# EAGLE design USB3.0 (EAGLE 9.6.1)
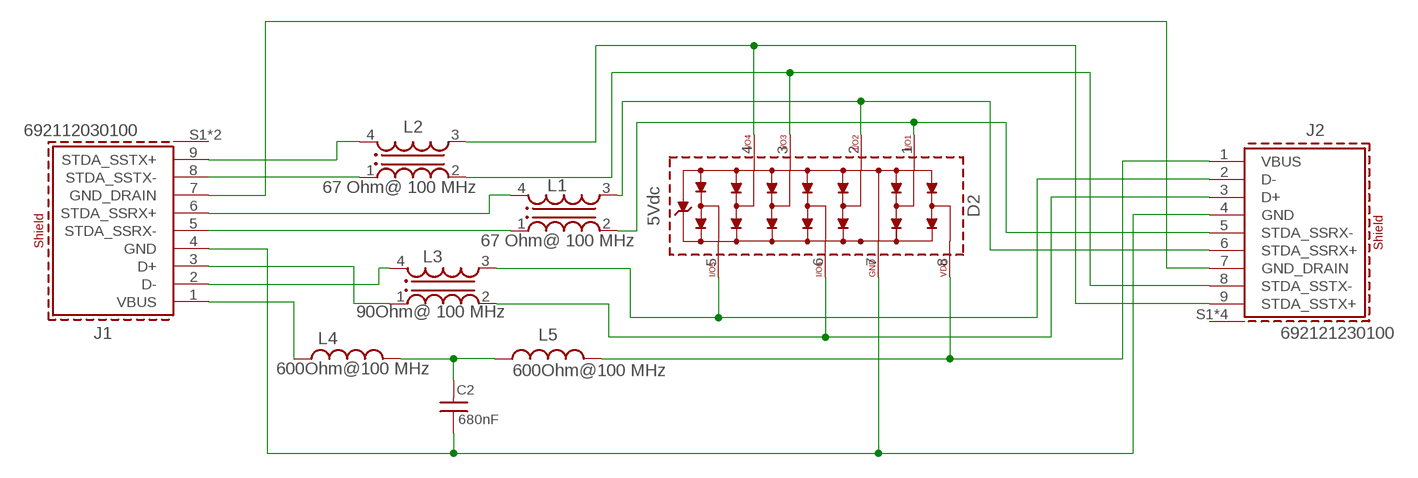
[diagram p0: schematic, sheet 1]

## Parts
C2  680nF  WCAP-CSGP_0603_885012206051_16V(DC)_W  [WCAP-CSGP_0603_W]
D2  5Vdc  WE-TVS-SS_MSOP-8L_82401646  [WE-TVS_MSOP-8L]
J1  692112030100  [692112030100]
J2  692121230100  [692121230100]
L1  67 Ohm@ 100 MHz  WE-CNSW_HF_0805_744233670  [WE-CNSW_HF_0805]
L2  67 Ohm@ 100 MHz  WE-CNSW_HF_0805_744233670  [WE-CNSW_HF_0805]
L3  90Ohm@ 100 MHz  WE-CNSW_1206_744232090  [WE-CNSW_1206]
L4  600Ohm@100 MHz  WE-CBF_0805_742792040_HC  [WE-CBF_0805(W=4.0)]
L5  600Ohm@100 MHz  WE-CBF_0805_742792040_HC  [WE-CBF_0805(W=4.0)]

## Nets
D_N: D2.5(I/O5) J2.2(D-) L3.3
D_P: D2.6(I/O6) J2.3(D+) L3.2
DX_N: J1.2(D-) L3.4
DX_P: J1.3(D+) L3.1
N$2: D2.8(VDD) J2.1(VBUS) L5.2
N$3: J1.7(GND_DRAIN) J2.7(GND_DRAIN)
N$5: C2.1 D2.7(GND) J1.4(GND) J2.4(GND)
N$11: C2.2 L4.2 L5.1
N$16: J1.1(VBUS) L4.1
R_N: D2.1(I/O1) J2.5(STDA_SSRX-) L1.2
R_P: D2.2(I/O2) J2.6(STDA_SSRX+) L1.3
RX_N: J1.5(STDA_SSRX-) L1.1
RX_P: J1.6(STDA_SSRX+) L1.4
T_N: D2.3(I/O3) J2.8(STDA_SSTX-) L2.2
T_P: D2.4(I/O4) J2.9(STDA_SSTX+) L2.3
TX_N: J1.8(STDA_SSTX-) L2.1
TX_P: J1.9(STDA_SSTX+) L2.4
Unconnected: J1.S1(SHIELD) J1.S2(SHIELD) J2.S1(SHIELD) J2.S2(SHIELD) J2.S3(SHIELD) J2.S4(SHIELD)

## Library data of the parts
C2 = Wurth_Capacitors_WCAP-CSGP:WCAP-CSGP_0603: WCAP-CSGP MLCCs 0603 General Purpose Characteristics General purpose product series High performance ceramic High electrical precision and stability ceramic especially for NP0 Minimal aging especially for NP0 Mounting style: SMT-Chip Ceramic: NP0 (Class I), X5R (Class II), X7R (Class II) Capacitance range: 1 pF ‒ 10 µF Temperature Coefficient: ±30 ppm/°C; ±0.54 % for NP0 ±15 % for X7R and X5R Voltage range (UR): 6.3 ‒ 100 V(DC) Operating temperature: -55 °C up to + 125 °C for NP0 and X7R -55 °C up to + 85 °C for X5R Termination: Cu/Ni/Sn Recommended soldering: Reflow and wave soldering Applications Temperature compensation (NP0) Coupling Decoupling Bypass Smoothing Filtering Resonant circuit <https://www.we-online.com/catalog/media/o177837v209%20MLCC_GRP_all.jpg> Details see: https://www.we-online.com/catalog/en/pbs/capacitors/multilayer_ceramic_chip_capacitors/mlcc_general_purpose Updated by Ella Wu 2022-06-20 2022(C) Würth Elektronik; CERAMIC-TYPE: X7R Class II; DATASHEET-URL: https://www.we-online.com/redexpert/spec/885012206051?ae; DF: 0.1; HEIGHT: 0.8mm; MOUNT: SMT; OPERATING-TEMPERATURE: -55 up to +125 °C; PART-NUMBER: 885012206051; QMIN: -; RISO: 0.7GOhm; SIZE: 0603; TECHNICAL-REFERENCE: X7R0603684K016DFCT10000; VR: 16V(DC)
D2 = Wurth_EMC Components_WE-TVS:WE-TVS-SS_MSOP-8L_82401646: WE-TVS TVS Diode – Super Speed Series Characteristics Fast turn-on Low clamping voltage Very low capacitance Rail to Rail protection Small package Epoxy flame resistant UL94-V0 Applications Super Speed data lines HDMI 1.3/1.4/2.0, DVI DisplayPort USB 3.1 Gen 1 (5Gb/s) SATA and eSATA GBit LAN Thunderbolt LVDS ESD protection in accordance with EN 61000-4-2 – 8 kV contact discharge – 15 kV air discharge SS = Super Speed <https://www.we-online.com/catalog/media/o106434v209%20Family_WE-TVS-SuperSpeed.jpg> Details see: https://www.we-online.com/catalog/en/WE-TVS-SS Details see: https://www.we-online.com/catalog/en/WE-TVS-SS Updated by Ella Wu 2021-12-16 2021(C) Wurth Elektronik; C-CH: 0.4pF; CHANNELS: 6+1; DATASHEET-URL: https://www.we-online.com/catalog/datasheet/82401646.pdf; IPEAK: -; MOUNT: SMT; PART-NUMBER: 82401646; VBR: 6V
J1 = Wurth_Connectors_WR-USB:692112030100: WR-COM USB 3.0 Type A SMT Plug with Clip Kind Properties Durability:5 000 Mating cycles Connector Type:USB Gender:Plug Type:Horizontal General Information Operating Temperature:-20up to +85 °C Compliance:RoHS Electrical Properties IR 1:1.8A Working Voltage:30V (AC) Withstanding Voltage:1000V (AC) Contact Resistance:50 mΩ Material Properties Insulator Material:LCP Insulator Flammability Rating:UL94 V-0 Color:Blue Contact Material:Phosphor Bronze Contact Plating:Matte Tin over Nickel Contact Type:Stamped Shielding Material:Steel Shielding Plating:Tin <https://www.we-online.com/catalog/media/o33019v209%20Family_WR-COM_692112030100.jpg> Details see: https://www.we-online.com/catalog/en/COM_3_0_SMT_TYPE_A_PLUG_WITH_CLIP/ Updated by Ella Wu 2021-09-28 2021 (C) Würth Elektronik; APPLICATION: USB 3.0; DATASHEET-URL: https://www.we-online.com/redexpert/spec/692112030100?ae; GERDER: Plug; INTERFACE-TYPE: Type A; IR: 1.8A; MOUNT: SMT; PACKAGING: Tray; PART-NUMBER: 692112030100; PINS: 9; TYPE: Horizontal; WORKING-VOLTAGE: 30V(AC)
J2 = Wurth_Connectors_WR-USB:692121230100: WR-COM USB 3.0 Type A Horizontal w. Offset 1.04 mm Kind Properties Durability:5 000 Mating cycles Quality Class:5 000 Mating cycles Connector Type:USB Gender:Receptacle Type:Horizontal General Information Operating Temperature:-20up to +85 °C Compliance:Lead free / RoHS Electrical Properties IR 1:1.8A Working Voltage:30V (AC) Withstanding Voltage:100V (AC) Contact Resistance:50 mΩ Material Properties Insulator Material:LCP Insulator Flammability Rating:UL94 V-0 Color:Blue Cover Material:Brass Cover Plating:Matte Tin Contact Material:Phosphor Bronze Contact Plating:Matte Tin over Nickel Contact Type:Stamped Shielding Material:Brass Shielding Plating:Matte Tin over Nickel <https://www.we-online.com/catalog/media/o33023v209%20Family_WR-COM_692121230100.jpg> Details see: https://www.we-online.com/catalog/en/COM_3_0_TYPE_A_HORIZONTAL_W_OFFSET_1_04MM/ Updated by Ella Wu 2021-09-28 2021 (C) Würth Elektronik; APPLICATION: USB 3.0; DATASHEET-URL: https://www.we-online.com/redexpert/spec/692121230100?ae; GERDER: Receptacle; INTERFACE-TYPE: Type A; IR: 1.8A; MOUNT: THR; PACKAGING: Tape and Reel; PART-NUMBER: 692121230100; PINS: 9; TYPE: Horizontal; WORKING-VOLTAGE: 30V(AC)
L1 L2 = Wurth_EMC Components_WE-CNSW_HF:WE-CNSW_HF_0805: WE-CNSW HF SMT Common Mode Line Filter Characteristics Current compensated data line filter High common mode noise suppression at high frequencies Small influence on high speed signals through winding symmetry Climatic category 40/105/21 (Size 0603) Climatic category 40/125/21 (Size 0805/1206/1812) Flammability corresponding to UL 94 V-0 Applications USB 3.0 USB 2.0 HDMI LVDS High-Speed data lines IEEE 1394 (Firewire) <https://katalog.we-online.com/media/images/v2/o35253v209%20Family_we-cnsw_stroko_smd_0805_HF.jpg> Details see: http://katalog.we-online.de/en/pbs/WE-CNSW_HF Updated by Ella Wu 2019-01-09 2019 (C) Wurth Elektronik; DATASHEET-URL: https://katalog.we-online.com/pbs/datasheet/744233670.pdf; FC: 6.5 GHz; IR: 320 mA; MOUNT: SMT; PART-NUMBER: 744233670; RDC: 240 mOhm; VR: 50V; VT: 125 V (AC)
L3 = Wurth_EMC Components_WE-CNSW:WE-CNSW_1206: WE-CNSW SMD Common Mode Line Filter Characteristics Current compensated data line filter High common mode noise suppression at high frequencies Small influence on high speed signals through winding symmetry Climatic category 40/105/21 (Size 0603) Climatic category 40/125/21 (Size 0805/1206/1812) Flammability corresponding to UL 94 V-0 Applications USB 2.0 IEEE 1394 (Firewire) LVDS High Speed Data Lines LAN <https://katalog.we-online.com/media/images/v2/o14771v209%20we-cnsw_stroko_smd_gruppe.jpg> Details see: http://katalog.we-online.de/en/pbs/WE-CNSW Updated by Ella Wu 2019-01-09 2019 (C) Wurth Elektronik; DATASHEET-URL: https://katalog.we-online.com/pbs/datasheet/744232090.pdf; IR: 370mA; MOUNT: SMT; PART-NUMBER: 744232090; RDC: 0.3Ohm; VR: 50V; VT: 125 V (DC)
L4 L5 = Wurth_EMC Components_WE-CBF:WE-CBF_0805: WE-CBF SMD EMI Suppression Ferrite Bead Characteristics Reliable Ni-Sn electrodes High rated current up to 6 A Operating temperature: –55 ºC to +125 ºC Applications Perfect as data lined filter and for uncoupling of distribution voltage Package name and Variant abbreviation: Package: Wide Band /High Speed: W=Width= 3.0 High Current: W=Width= 4.0 Variant abbreviation: WB = Wide Band HS=High Speed HC=High Current <https://www.we-online.com/catalog/media/o14753v209%20Family_WE-CBF.jpg> Details see: https://www.we-online.com/katalog/en/WE-CBF Updated by Ella Wu 2021-1-12 2021(C) Wurth Elektronik; DATASHEET-URL: https://www.we-online.com/catalog/datasheet/742792040.pdf; IR2: 2000mA; MOUNT: SMT; PART-NUMBER: 742792040; RDC-MAX: 0.15Ohm; TYPE: High Current; Z-MAX: 700Ohm@150 MHz

## Board
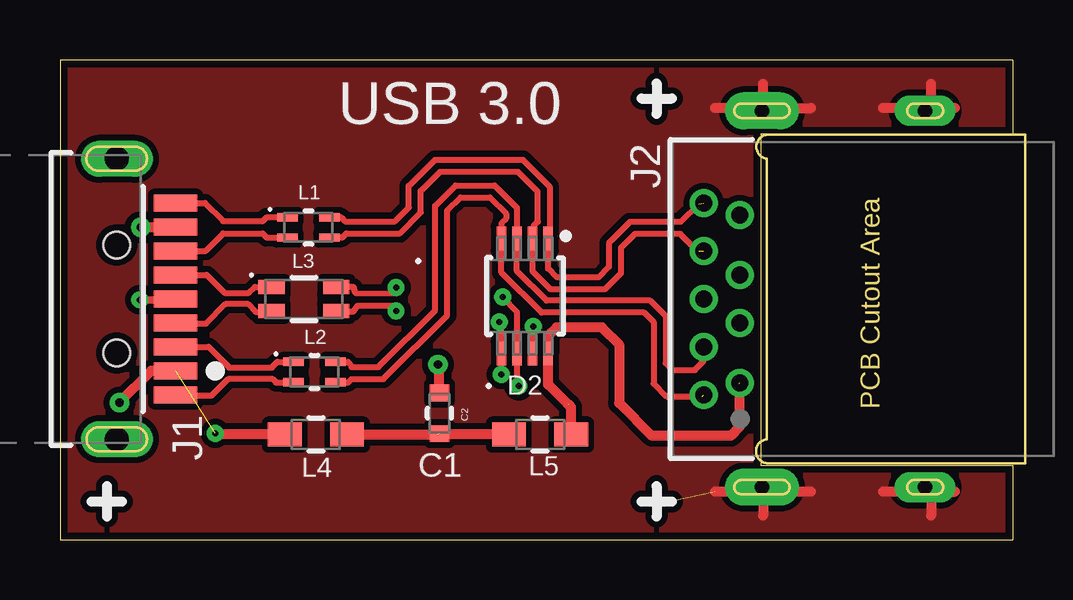
[diagram p1: board, top side]
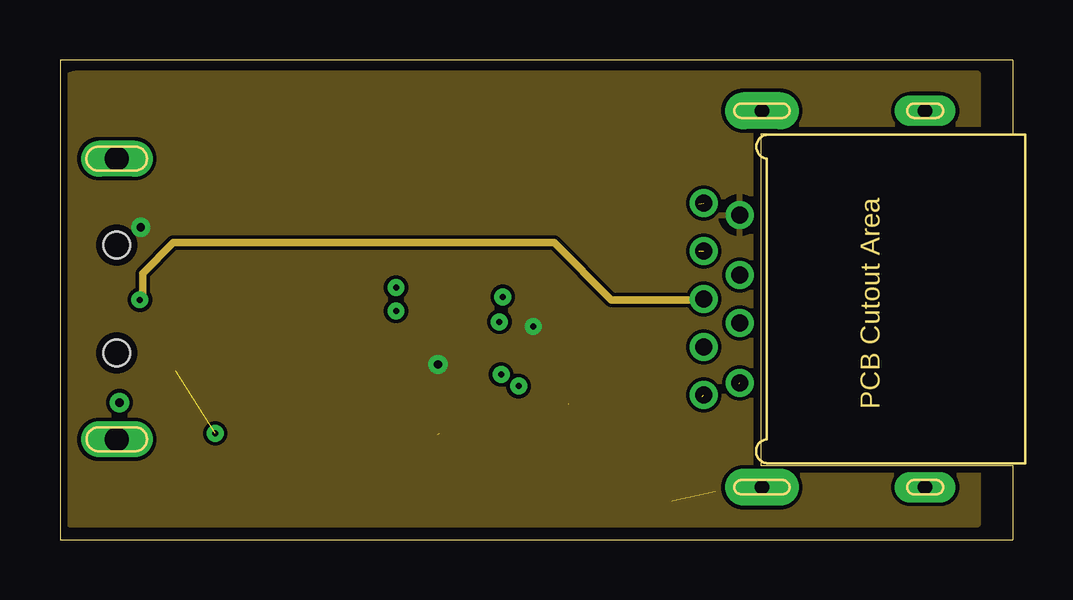
[diagram p2: board, inner layer InnerLayer1]
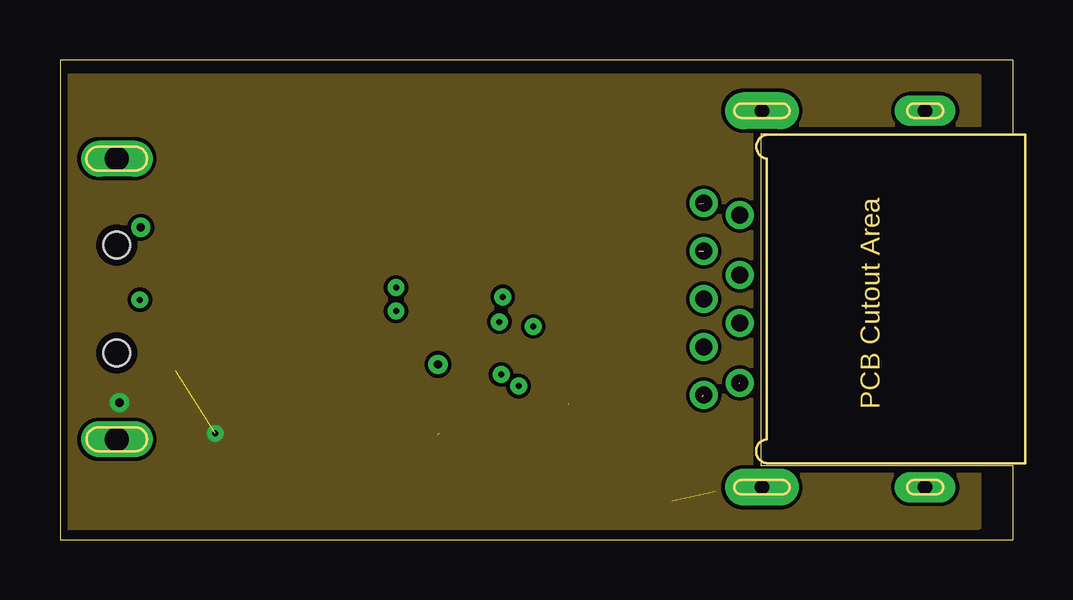
[diagram p3: board, inner layer InnerLayer2]
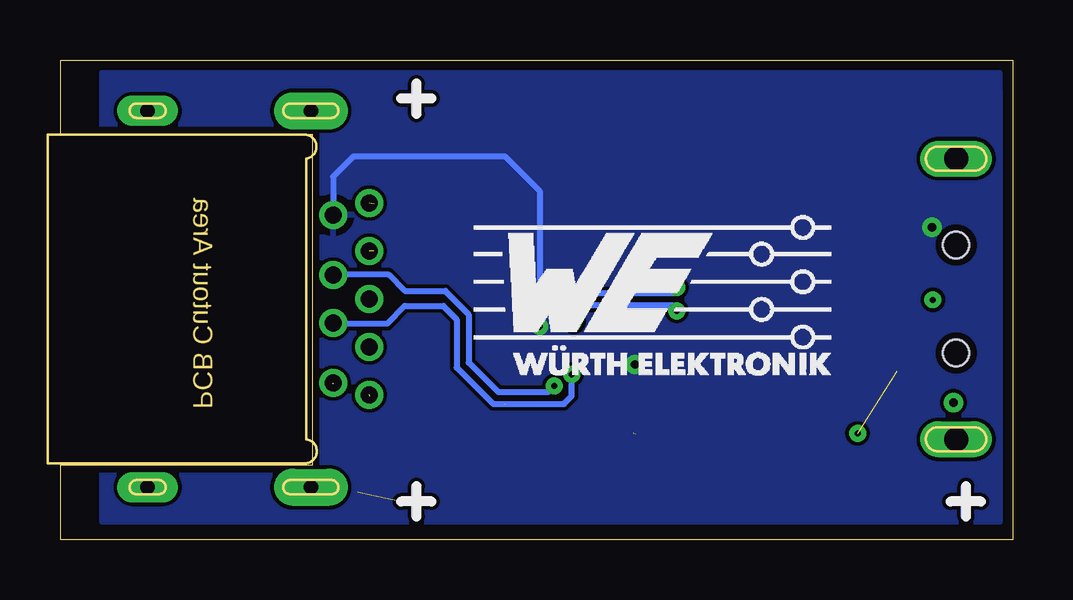
[diagram p4: board, bottom side, seen from below]

Size 39.7 x 20 mm. Coordinates in mm from the lower left corner, seen from the top.
Outline: 0,0 39.7,0 39.7,3.1 29.2,3.1 29.2,16.9 39.7,16.9 39.7,20 0,20 0,0
Copper layers (1*2+3*4+5*6+7*16): Top 0.035mm / dielectric 0.2mm / InnerLayer1 0.035mm / dielectric 0.15mm / InnerLayer2 0.035mm / dielectric 0.2mm / Route4 0.035mm / dielectric 0.15mm / Route5 0.035mm / dielectric 0.2mm / Route6 0.035mm / dielectric 0.15mm / Route7 0.035mm / dielectric 0.2mm / Bottom 0.035mm
Design rules "Eagle_WEdirekt_150_check *": minimum track width 6mil, minimum drill 0.2mm, track to track 6mil, track to pad 6mil, pad to pad 8mil, via to via 6mil, smd to smd 8mil, copper to edge 12mil, drill to drill 24mil, minimum pad ring 9mil, minimum via ring 9mil, stop-mask expansion 3mil, vias tented up to drill 2mm, thermal gap 12mil

### Footprints (pad centres in the part's own frame; a part is rotated, then mirrored left to right if it is on the bottom)
WCAP-CSGP_0603_W = smd 0.7 x 0.8: 1 -0.85,0; 2 0.85,0
WE-TVS_MSOP-8L = smd 0.4 x 1: 1 -0.975,-2.4; 2 -0.325,-2.4; 3 0.325,-2.4; 4 0.975,-2.4; 5 0.975,2.4; 6 0.325,2.4; 7 -0.325,2.4; 8 -0.975,2.4
692112030100 = smd 0.7 x 1.8: 1 3,10.85; 2 1,10.85; 3 -1,10.85; 4 -3,10.85; 5 -4,10.85; 6 -2,10.85; 7 0,10.85; 8 2,10.85; 9 4,10.85 | drill 1 pad 1 long: S1 -5.85,8.4; S2 5.85,8.4 | hole 1.1: 2.25,8.4; -2.25,8.4
692121230100 = drill 0.7: 1 -3.5,5.145; 2 -1,5.145; 3 1,5.145; 4 3.5,5.145; 5 4,6.645; 6 2,6.645; 7 0,6.645; 8 -2,6.645; 9 -4,6.645 | drill 0.6 pad 1.54 long: S1 -7.85,4.215; S2 7.85,4.215 | drill 0.6 pad 1.27 long: S3 7.85,-2.585; S4 -7.85,-2.585
WE-CNSW_HF_0805 = smd 0.85 x 0.35: 1 -0.875,0.425; 2 0.875,0.425; 3 0.875,-0.425; 4 -0.875,-0.425
WE-CNSW_1206 = smd 1.1 x 0.6: 1 -1.35,0.5; 2 1.35,0.5; 3 1.35,-0.5; 4 -1.35,-0.5
WE-CBF_0805(W=4.0) = smd 1.4 x 1: 1 -1.3,0; 2 1.3,0

### Placement (x,y rotation side)
C2  15.81,5.27 270 top
D2  19.37,10.16 180 top
J1  -6.03,10.03 270 top
J2  33.46,10.03 90 top
L1  10.35,13.02 0 top
L2  10.6,6.99 0 top
L3  10.16,10.03 0 top
L4  10.67,4.38 0 top
L5  20,4.38 0 top

### Tracks (layer width: path | path; a pad name or v marks a point on that pad's centre or on a via)
D_N  (via drill 0.25)
  Top 0.254: v14,9.53 14,9.77 12.4,9.76 12.2,9.5 11.54,9.5 L3.3 | v18.31,9.08 18.37,9.02 18.37,7.78 D2.5 18.38,7.75 v18.38,6.89
  Bottom 0.152: 28.29,9 J2.2
  Bottom 0.254: v18.38,6.89 18.38,5.98 18.71,5.65 21.64,5.65 23.17,7.18 23.17,9.19 23.72,9.74 25.33,9.74 26.07,9 28.29,9 | v18.31,9.08 18.31,9.19 17.73,9.77 14,9.77 v14,9.53
D_P  (via drill 0.25)
  Top 0.254: v18.45,10.12 19.03,9.51 19.04,9.49 D2.6 19.04,6.47 v19.11,6.4 | v14,10.51 14,10.27 12.33,10.28 12.24,10.5 12.21,10.53 L3.2
  Bottom 0.152: J2.3 28.3,11.05
  Bottom 0.254: 28.3,11.05 26.01,11.05 25.33,10.37 23.64,10.37 22.67,9.39 22.67,7.38 21.44,6.15 19.36,6.15 v19.11,6.4 | v18.45,10.12 v18.44,10.12 18.29,10.27 14.13,10.27 14.13,10.51 v14,10.51
DX_N
  Top 0.152: 4.85,9 J1.2
  Top 0.254: 4.85,9 6.08,9 6.89,9.81 7.83,9.81 8.15,9.5 8.78,9.5 L3.4
DX_P
  Top 0.254: J1.3 6.11,11.03 6.86,10.29 7.87,10.29 8.13,10.54 8.8,10.54 L3.1
N$2  (2 unrouted)
  Top 0.406: 28.31,6.5 28.31,4.68 27.96,4.33 24.66,4.33 23.3,5.69 23.3,8.13 22.58,8.85 20.69,8.85 20.34,8.5 D2.8 20.34,6.46 21.17,5.63 | 21.17,5.66 21.3,5.52 L5.2
N$3  (via drill 0.25)
  Top 0.254: J1.7 4.78,10
  Top 0.305: 4.78,10 v3.33,10
  InnerLayer1 0.152: 26.79,10 J2.7
  InnerLayer1 0.305: v3.33,10 3.44,10.24 3.44,11.1 4.72,12.38 20.59,12.38 22.97,10 26.79,10
N$5  (via drill 0.25, 0.35)
  Top 0.254: D2.7 19.69,8.86 v19.72,8.89
  Top 0.406: C2.1 15.81,7.24 v15.75,7.3 | J1.4 4.8,13.02 v3.36,13.02
  Bottom 0.152: 28.3,15.15 28.32,15.13
  Bottom 0.254: 28.32,15.13 J2.4 | 28.3,15.15 27.47,15.98 21.16,15.98 19.72,14.54 v19.72,8.89
  pour Bottom: 0.54,18.71 0.54,0.75 37.95,0.75 37.95,19.46 0.56,19.46 0.56,18.67
  pour InnerLayer1: 0.39,19.35 0.39,0.64 38.26,0.64 38.26,19.42 0.63,19.42
N$11  (1 unrouted)
  Top 0.406: L4.2 15.72,4.38 | L5.1 15.85,4.38 C2.2
N$16  (via drill 0.25, 0.35)  (1 unrouted)
  Top 0.406: v2.47,5.71 3.79,7.03 J1.1 | L4.1 6.52,4.38 v6.47,4.43
  pour InnerLayer2: 0.38,18.97 0.33,18.97 0.33,0.54 38.29,0.54 38.29,19.3 0.34,19.3 0.34,19
R_N  (1 unrouted)
  Top 0.152: 11.75,13.4 11.71,13.44
  Top 0.254: 11.75,13.4 11.88,13.27 13.96,13.27 14.54,13.85 14.53,14.74 15.63,15.84 19.28,15.84 20.41,14.72 20.41,12.62 D2.1 20.34,11.29 20.7,10.94 22.44,10.94 22.87,11.37 22.87,12.36 23.75,13.24 25.85,13.24 26.61,14 | 11.71,13.44 L1.2
R_P  (1 unrouted)
  Top 0.152: 11.76,12.6 11.75,12.59 | 26.62,12.03 26.59,12
  Top 0.254: 11.76,12.6 11.93,12.77 14.16,12.77 15.04,13.65 15.03,14.54 15.83,15.34 19.08,15.34 19.9,14.52 19.91,13.26 19.72,13.07 19.72,12.59 D2.2 19.69,11.18 20.44,10.43 22.7,10.43 23.37,11.1 23.37,12.16 23.95,12.74 25.85,12.74 26.59,12 | 11.75,12.59 L1.3
RX_N
  Top 0.254: J1.5 6.03,14.03 6.79,13.27 8.44,13.27 8.62,13.44 L1.1
RX_P
  Top 0.254: J1.6 6.06,12.03 6.79,12.76 8.44,12.76 8.62,12.59 L1.4
S$2
  Top 0.406: 24.86,2.22 24.86,0.95
S$3
  Top 0.406: 24.22,1.59 25.49,1.59
S$5  (1 unrouted)
  Top 0.406: 29.3,18 29.3,19 | 29.3,18 27.3,18 | 29.3,18 31.3,18 | 36.3,18 34.3,18 | 36.3,18 36.3,19 | 36.3,18 37.3,18 | 31.3,2 29.3,2 | 29.3,2 29.3,1 | 29.3,2 27.3,2 | 36.3,2 36.3,1 | 36.3,2 37.3,2 | 36.3,2 34.3,2
  Bottom 0.406: 24.22,1.59 25.49,1.59
  pour Top (isolate 0.254, rank 2): -1.7,21 42.3,21 42.3,-1 -1.7,-1 -1.7,20
S$6
  Top 0.406: 24.86,19.02 24.86,17.75
S$7
  Top 0.406: 24.22,18.39 25.49,18.39
S$8
  Bottom 0.406: 24.22,18.39 25.49,18.39
S$9
  Bottom 0.406: 24.86,17.75 24.86,19.02
S$10
  Bottom 0.406: 24.86,0.95 24.86,2.22
S$13
  Top 0.406: 1.95,2.22 1.95,0.95
S$14
  Top 0.406: 1.32,1.59 2.59,1.59
S$15
  Bottom 0.406: 1.32,1.59 2.59,1.59
S$16
  Bottom 0.406: 1.95,0.95 1.95,2.22
T_N
  Top 0.152: 11.99,7.41 12.05,7.35 | 26.8,7.42 26.82,7.44
  Top 0.254: 12.05,7.35 12.15,7.19 13.27,7.19 15.63,9.55 15.63,13.91 16.49,14.77 18.11,14.77 19.04,13.84 D2.3 19.04,11.19 20.27,9.96 24.59,9.96 25.23,9.32 25.23,7.36 25.52,7.07 26.45,7.07 26.8,7.42 | L2.2 11.99,7.41 | 26.82,7.44 J2.8
T_P  (1 unrouted)
  Top 0.152: 12,6.56 12.01,6.55
  Top 0.254: 26.77,5.97 25.27,5.97 24.73,6.51 24.73,9.08 24.35,9.46 20.07,9.46 18.39,11.13 D2.4 18.39,13.2 18.58,13.39 18.58,13.59 17.91,14.27 16.69,14.27 16.14,13.72 16.14,13.71 16.13,13.7 16.13,9.35 13.47,6.69 12.15,6.69 12.01,6.55 | L2.3 12,6.56
TX_N
  Top 0.254: J1.8 6.19,8.03 7.05,7.18 8.83,7.18 9.06,7.41 L2.1
TX_P
  Top 0.152: 4.85,6 J1.9 | 9.72,6.55 L2.4
  Top 0.254: 4.85,6 6.31,6 7,6.69 8.86,6.69 9,6.55 9.72,6.55

### Text on the board
tPlace: USB 3.0
tNames: C1
Measures: 20,0 mm | 39,7 mm